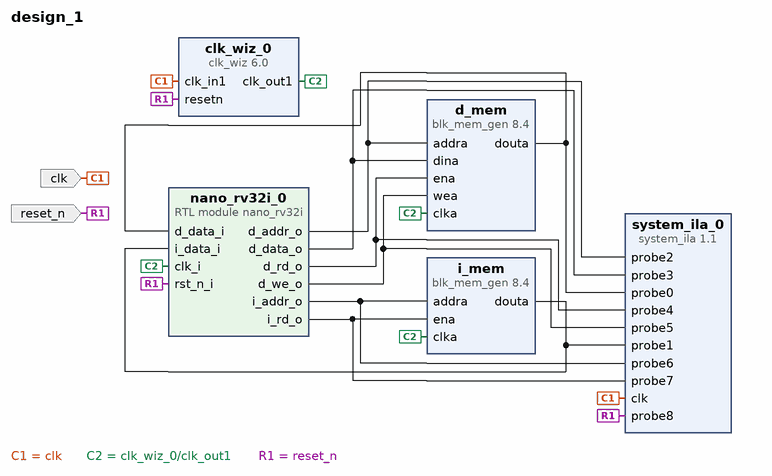
[diagram p0: block diagram of the top level]
# Vivado block design design_1, xc7a100tcsg324-1, Vivado 2023.2
create_bd_design design_1

create_bd_port -dir I -type clk clk
create_bd_port -dir I -type rst reset_n
set_property -dict {CONFIG.POLARITY ACTIVE_LOW} [get_bd_ports reset_n]

create_bd_cell -type ip -vlnv xilinx.com:ip:clk_wiz:6.0 clk_wiz_0
set_property -dict [list \
  CONFIG.CLKOUT1_JITTER 290.478 \
  CONFIG.CLKOUT1_PHASE_ERROR 133.882 \
  CONFIG.CLKOUT1_REQUESTED_OUT_FREQ 10.000 \
  CONFIG.MMCM_CLKFBOUT_MULT_F 15.625 \
  CONFIG.MMCM_CLKOUT0_DIVIDE_F 78.125 \
  CONFIG.MMCM_DIVCLK_DIVIDE 2 \
  CONFIG.RESET_PORT resetn \
  CONFIG.RESET_TYPE ACTIVE_LOW \
] [get_bd_cells clk_wiz_0]
create_bd_cell -type module -reference nano_rv32i nano_rv32i_0
create_bd_cell -type ip -vlnv xilinx.com:ip:blk_mem_gen:8.4 d_mem
set_property -dict {CONFIG.EN_SAFETY_CKT false} [get_bd_cells d_mem]
create_bd_cell -type ip -vlnv xilinx.com:ip:blk_mem_gen:8.4 i_mem
set_property -dict [list \
  CONFIG.Coe_File {../../../../../../../../Escritorio/PERTE/Diseño_de_Circuitos/Lab3/nano-rv32i-solucion/nano-rv32i/src/instructions.coe} \
  CONFIG.EN_SAFETY_CKT false \
  CONFIG.Load_Init_File true \
  CONFIG.Memory_Type Single_Port_ROM \
] [get_bd_cells i_mem]
create_bd_cell -type ip -vlnv xilinx.com:ip:system_ila:1.1 system_ila_0
set_property -dict [list \
  CONFIG.C_MON_TYPE NATIVE \
  CONFIG.C_NUM_OF_PROBES 9 \
  CONFIG.C_PROBE0_TYPE 0 \
  CONFIG.C_PROBE1_TYPE 0 \
  CONFIG.C_PROBE2_TYPE 0 \
  CONFIG.C_PROBE3_TYPE 0 \
  CONFIG.C_PROBE4_TYPE 0 \
  CONFIG.C_PROBE5_TYPE 0 \
  CONFIG.C_PROBE6_TYPE 0 \
  CONFIG.C_PROBE7_TYPE 0 \
  CONFIG.C_PROBE8_TYPE 0 \
] [get_bd_cells system_ila_0]

# ---- connections ----

connect_bd_net -net clk_in1_0_1 [get_bd_ports clk] [get_bd_pins clk_wiz_0/clk_in1] [get_bd_pins system_ila_0/clk]
connect_bd_net [get_bd_pins clk_wiz_0/clk_out1] [get_bd_pins nano_rv32i_0/clk_i] [get_bd_pins i_mem/clka] [get_bd_pins d_mem/clka]
connect_bd_net -net d_mem_douta [get_bd_pins d_mem/douta] [get_bd_pins nano_rv32i_0/d_data_i] [get_bd_pins system_ila_0/probe0]
connect_bd_net -net i_mem_douta [get_bd_pins i_mem/douta] [get_bd_pins nano_rv32i_0/i_data_i] [get_bd_pins system_ila_0/probe1]
connect_bd_net -net nano_rv32i_0_d_addr_o [get_bd_pins nano_rv32i_0/d_addr_o] [get_bd_pins d_mem/addra] [get_bd_pins system_ila_0/probe2]
connect_bd_net -net nano_rv32i_0_d_data_o [get_bd_pins nano_rv32i_0/d_data_o] [get_bd_pins d_mem/dina] [get_bd_pins system_ila_0/probe3]
connect_bd_net -net nano_rv32i_0_d_rd_o [get_bd_pins nano_rv32i_0/d_rd_o] [get_bd_pins d_mem/ena] [get_bd_pins system_ila_0/probe4]
connect_bd_net -net nano_rv32i_0_d_we_o [get_bd_pins nano_rv32i_0/d_we_o] [get_bd_pins d_mem/wea] [get_bd_pins system_ila_0/probe5]
connect_bd_net -net nano_rv32i_0_i_addr_o [get_bd_pins nano_rv32i_0/i_addr_o] [get_bd_pins i_mem/addra] [get_bd_pins system_ila_0/probe6]
connect_bd_net -net nano_rv32i_0_i_rd_o [get_bd_pins nano_rv32i_0/i_rd_o] [get_bd_pins i_mem/ena] [get_bd_pins system_ila_0/probe7]
connect_bd_net -net reset_n_1 [get_bd_ports reset_n] \
  [get_bd_pins clk_wiz_0/resetn] [get_bd_pins nano_rv32i_0/rst_n_i] [get_bd_pins system_ila_0/probe8]
set_property HDL_ATTRIBUTE.DEBUG true [get_bd_nets d_mem_douta]
set_property HDL_ATTRIBUTE.MARK_DEBUG true [get_bd_nets d_mem_douta]
set_property HDL_ATTRIBUTE.DEBUG true [get_bd_nets i_mem_douta]
set_property HDL_ATTRIBUTE.MARK_DEBUG true [get_bd_nets i_mem_douta]
set_property HDL_ATTRIBUTE.DEBUG true [get_bd_nets nano_rv32i_0_d_addr_o]
set_property HDL_ATTRIBUTE.MARK_DEBUG true [get_bd_nets nano_rv32i_0_d_addr_o]
set_property HDL_ATTRIBUTE.DEBUG true [get_bd_nets nano_rv32i_0_d_data_o]
set_property HDL_ATTRIBUTE.MARK_DEBUG true [get_bd_nets nano_rv32i_0_d_data_o]
set_property HDL_ATTRIBUTE.DEBUG true [get_bd_nets nano_rv32i_0_d_rd_o]
set_property HDL_ATTRIBUTE.MARK_DEBUG true [get_bd_nets nano_rv32i_0_d_rd_o]
set_property HDL_ATTRIBUTE.DEBUG true [get_bd_nets nano_rv32i_0_d_we_o]
set_property HDL_ATTRIBUTE.MARK_DEBUG true [get_bd_nets nano_rv32i_0_d_we_o]
set_property HDL_ATTRIBUTE.DEBUG true [get_bd_nets nano_rv32i_0_i_addr_o]
set_property HDL_ATTRIBUTE.MARK_DEBUG true [get_bd_nets nano_rv32i_0_i_addr_o]
set_property HDL_ATTRIBUTE.DEBUG true [get_bd_nets nano_rv32i_0_i_rd_o]
set_property HDL_ATTRIBUTE.MARK_DEBUG true [get_bd_nets nano_rv32i_0_i_rd_o]
set_property HDL_ATTRIBUTE.DEBUG true [get_bd_nets reset_n_1]
set_property HDL_ATTRIBUTE.MARK_DEBUG true [get_bd_nets reset_n_1]

validate_bd_design
save_bd_design
